# Altium project PCB_Project.PrjPcb
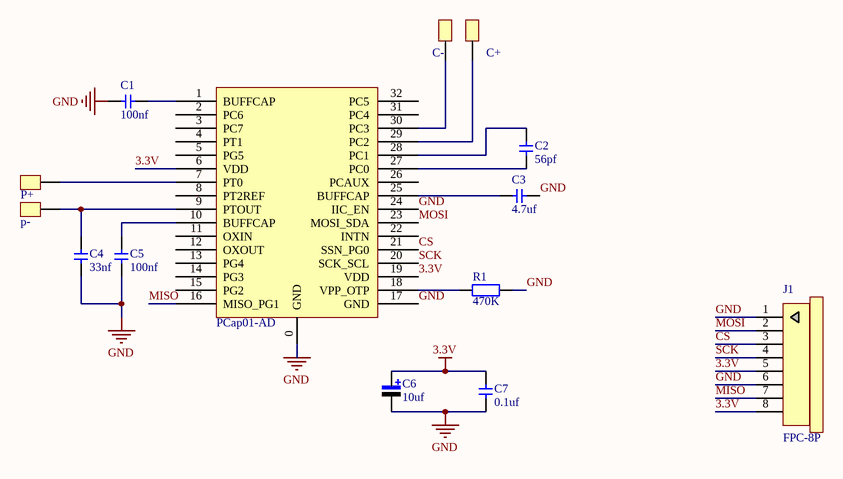
[diagram p0: 电容测量.SchDoc]
1 sheet, 14 parts. Net scope: global (net labels, ports and power ports of the same name join across sheets).
Board file: PCB1.PcbDoc

## Sheet 电容测量.SchDoc
size A4

### Parts
C1  value 100nf  [0603-2]  (hidden comment: Cap)
C2  value 56pf  [0603-2]  (hidden comment: Cap)
C3  value 4.7uf  [0603-2]  (hidden comment: Cap)
C4  value 33nf  [0603-2]  (hidden comment: Cap)
C5  value 100nf  [0603-2]  (hidden comment: Cap)
C6  value 10uf  [CAP-3216]  (hidden comment: Cap Pol)
C7  value 0.1uf  [0603-2]  (hidden comment: Cap)
C+  pad  [pad_3x3]  (value not drawn)
C-  pad  [pad_3x3]  (value not drawn)
J1  FPC-8P  [FPC0.5-8P-C]
P+  pad  [pad_3x3]  (value not drawn)
p-  pad  [pad_3x3]  (value not drawn)
R1  value 470K  [0603-2]  (hidden comment: Res1)
U1  PCap01-AD  [QFN-32_5x5x05]

### Nets
3.3V: C6.1 C7.2 J1.5 J1.8 U1.6(VDD) U1.19(VDD)
GND: C1.2 C3.1 C4.2 C5.1 C6.2 C7.1 J1.1 J1.6 R1.2 U1.0(GND) U1.17(GND) U1.24(IIC_EN)
CS: J1.3 U1.21(SSN_PG0)
MISO: J1.7 U1.16(MISO_PG1)
MOSI: J1.2 U1.23(MOSI_SDA)
SCK: J1.4 U1.20(SCK_SCL)
NetC1_1: C1.1 U1.1(BUFFCAP)
NetC2_1: C2.1 U1.27(PC0)
NetC2_2: C2.2 U1.28(PC1)
NetC3_2: C3.2 U1.25(BUFFCAP)
NetC4_1: C4.1 p-.1 U1.9(PTOUT)
NetC5_2: C5.2 U1.10(BUFFCAP)
NetC+_1: C+.1 U1.29(PC2)
NetC-_1: C-.1 U1.30(PC3)
NetP+_1: P+.1 U1.7(PT0)
NetR1_1: R1.1 U1.18(VPP_OTP)

Not connected (* = marked no-connect by the designer): U1 2(PC6) 3(PC7) 4(PT1) 5(PG5) 8(PT2REF) 11(OXIN) 12(OXOUT) 13(PG4) 14(PG3) 15(PG2) 22(INTN) 26(PCAUX) 31(PC4) 32(PC5)

### Library data of the parts
C1-C5 C7 = Cap: 无极性电容; Published: 8-Jun-2000; LatestRevisionDate: 17-Jul-2002; LatestRevisionNote: Re-released for DXP Platform.; PackageReference: RAD-0.3; Publisher: Altium Limited
C6 = Cap Pol: 极性电解电容; Vol: 16V; Published: 8-Jun-2000; LatestRevisionDate: 17-Jul-2002; LatestRevisionNote: Re-released for DXP Platform.; PackageReference: RB7.6-15; Publisher: Altium Limited
C+ C- P+ p- = pad_3x3: 焊盘接口
J1 = FPC-8P: FPC排线连接器
R1 = Res1: 贴片电阻; Published: 8-Jun-2000; LatestRevisionDate: 17-Jul-2002; LatestRevisionNote: Re-released for DXP Platform.; PackageReference: AXIAL-0.4; Publisher: Altium Limited
U1 = Pcap01AD: 电容测量芯片